# EAGLE design G008A (EAGLE 6.6.0)
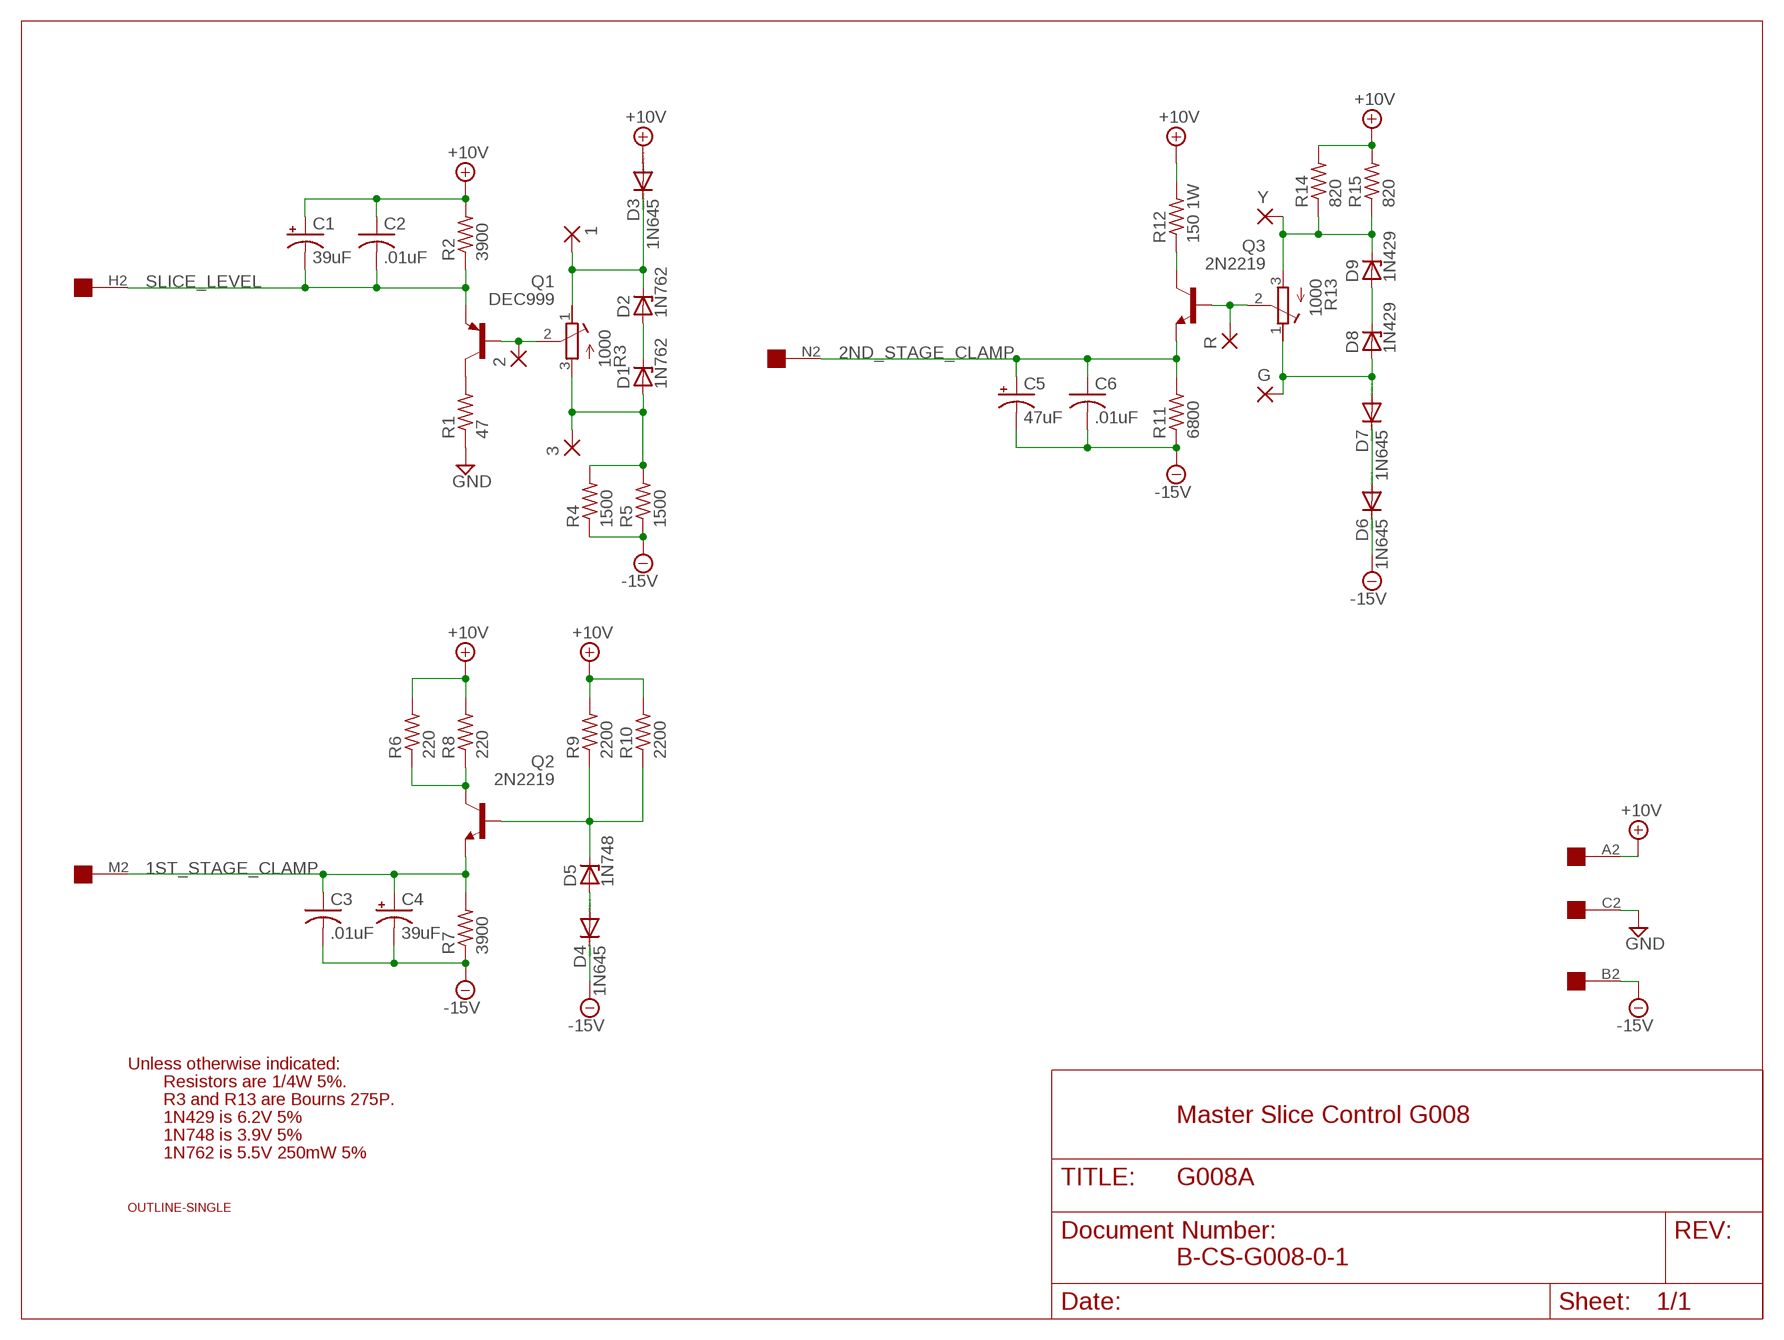
[diagram p0: schematic, sheet 1]

## Parts
1  2,54/0,8  [2,54/0,8]
2  2,54/0,8  [2,54/0,8]
3  2,54/0,8  [2,54/0,8]
C1  39uF  CPOL-USE15-5AXIAL  [E15-5]
C2  .01uF  C-US050-025X075  [C050-025X075]
C3  .01uF  C-US050-025X075  [C050-025X075]
C4  39uF  CPOL-USE15-5AXIAL  [E15-5]
C5  47uF  CPOL-USE22-6AXIAL  [E22-6]
C6  .01uF  C-US050-025X075  [C050-025X075]
D1  1N762  ZENER-DIODEDO35Z10  [DO35Z10]
D2  1N762  ZENER-DIODEDO35Z10  [DO35Z10]
D3  1N645  1N4148DO35-10  [DO35-10]
D4  1N645  1N4148DO35-10  [DO35-10]
D5  1N748  ZENER-DIODEDO35Z10  [DO35Z10]
D6  1N645  1N4148DO35-10  [DO35-10]
D7  1N645  1N4148DO35-10  [DO35-10]
D8  1N429  ZENER-DIODEDO35Z10  [DO35Z10]
D9  1N429  ZENER-DIODEDO35Z10  [DO35Z10]
G  2,54/0,8  [2,54/0,8]
Q1  DEC999  2N2904  [TO39]
Q2  2N2219  2N2102  [TO5]
Q3  2N2219  2N2102  [TO5]
R  2,54/0,8  [2,54/0,8]
R1  47  R-US_0207/10  [0207/10]
R2  3900  R-US_0207/10  [0207/10]
R3  1000  275P  [3006Y]
R4  1500  R-US_0207/10  [0207/10]
R5  1500  R-US_0207/10  [0207/10]
R6  220  R-US_0207/10  [0207/10]
R7  3900  R-US_0207/10  [0207/10]
R8  220  R-US_0207/10  [0207/10]
R9  2200  R-US_0207/10  [0207/10]
R10  2200  R-US_0207/10  [0207/10]
R11  6800  R-US_0207/10  [0207/10]
R12  150 1W  R-US_0617/22  [0617/22]
R13  1000  275P  [3006Y]
R14  820  R-US_0207/10  [0207/10]
R15  820  R-US_0207/10  [0207/10]
U$1  OUTLINE-SINGLE  [SINGLE]
U$2  EDGE-1  [EDGE-CON1]
Y  2,54/0,8  [2,54/0,8]

## Nets
1ST_STAGE_CLAMP: C3.1 C4.+ Q2.1(E) R7.2 U$2.M2
2ND_STAGE_CLAMP: C5.+ C6.1 Q3.1(E) R11.2 U$2.N2
+10V: C1.+ C2.1 D3.A R2.2 R6.2 R8.2 R9.2 R10.2 R12.2 R14.2 R15.2 U$2.A2
-15V: C3.2 C4.- C5.- C6.2 D4.C D6.C R4.1 R5.1 R7.1 R11.1 U$2.B2
GND [Supply]: R1.1 U$2.C2
N$1: 3.1(P) D1.A R3.3(E) R4.2 R5.2
N$2: Q2.3(C) R6.1 R8.1
N$3: D1.C D2.A
N$4: Q1.3(C) R1.2
N$5: D4.A D5.A
N$6: Q3.3(C) R12.1
N$7: D5.C Q2.2(B) R9.1 R10.1
N$8: Q3.2(B) R13.2(S) R.1(P)
N$9: D6.A D7.C
N$10: D7.A D8.A G.1(P) R13.1(A)
N$11: D8.C D9.A
N$12: D9.C R13.3(E) R14.1 R15.1 Y.1(P)
N$39: 1.1(P) D2.C D3.C R3.1(A)
N$40: 2.1(P) Q1.2(B) R3.2(S)
SLICE_LEVEL: C1.- C2.2 Q1.1(E) R2.1 U$2.H2
Unconnected: U$2.D2 U$2.E2 U$2.F2 U$2.J2 U$2.K2 U$2.L2 U$2.P2 U$2.R2 U$2.S2 U$2.T2 U$2.U2 U$2.V2

## Notes on the sheet
- Unless otherwise indicated:
- Resistors are 1/4W 5%.
- R3 and R13 are Bourns 275P.
- 1N429 is 6.2V 5% | Master Slice Control G008
- 1N748 is 3.9V 5%
- 1N762 is 5.5V 250mW 5%
- B-CS-G008-0-1

## Library data of the parts
1-3 G R Y = wirepad:2,54/0,8: THROUGH-HOLE PAD
C1 C4 C5 = rcl:CPOL-US: POLARIZED CAPACITOR, American symbol
C2 C3 C6 = rcl:C-US: CAPACITOR, American symbol
D1 D2 D5 D8 D9 = diode:ZENER-DIODE: Z-Diode
D3 D4 D6 D7 = diode:1N4148: DIODE high speed (Philips)
Q1 = transistor-pnp:2N2904*: PNP Transistror
Q2 Q3 = transistor:2N2102: NPN TRANSISTOR
R1 R2 R4-R12 R14 R15 = rcl:R-US_: RESISTOR, American symbol
R3 R13 = dec-con:275P: Trimpot with 275P (3006Y) footprint.
U$1 = dec-con:OUTLINE-*: Board outlines for DEC boards.
U$2 = dec-con:EDGE-1: Single-Sided DEC Edge Connector -- (side 2)

## Net classes
1 Supply: width 0.813 mm

## Board
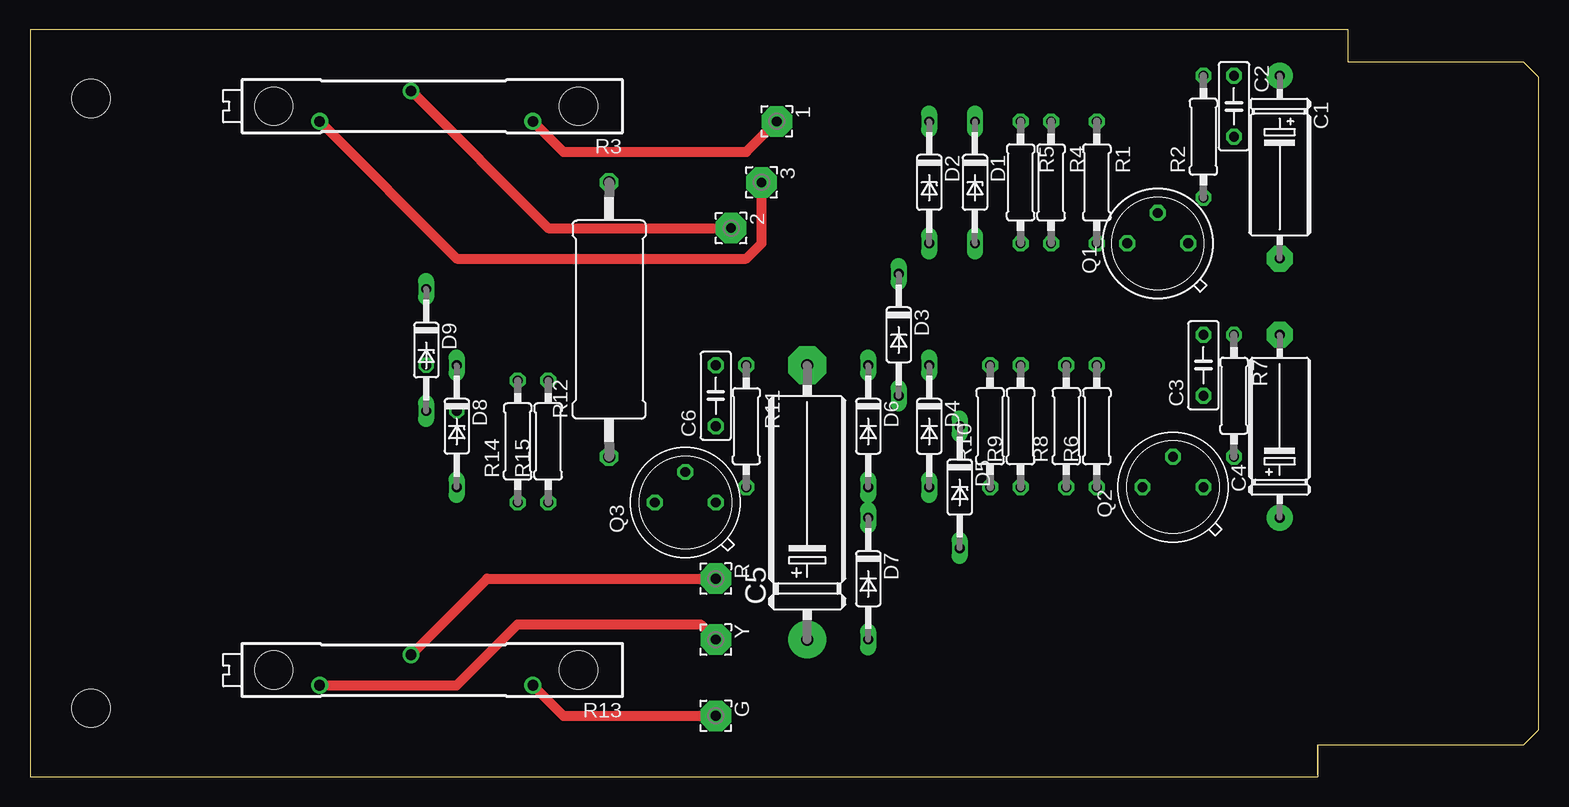
[diagram p1: board, top side]
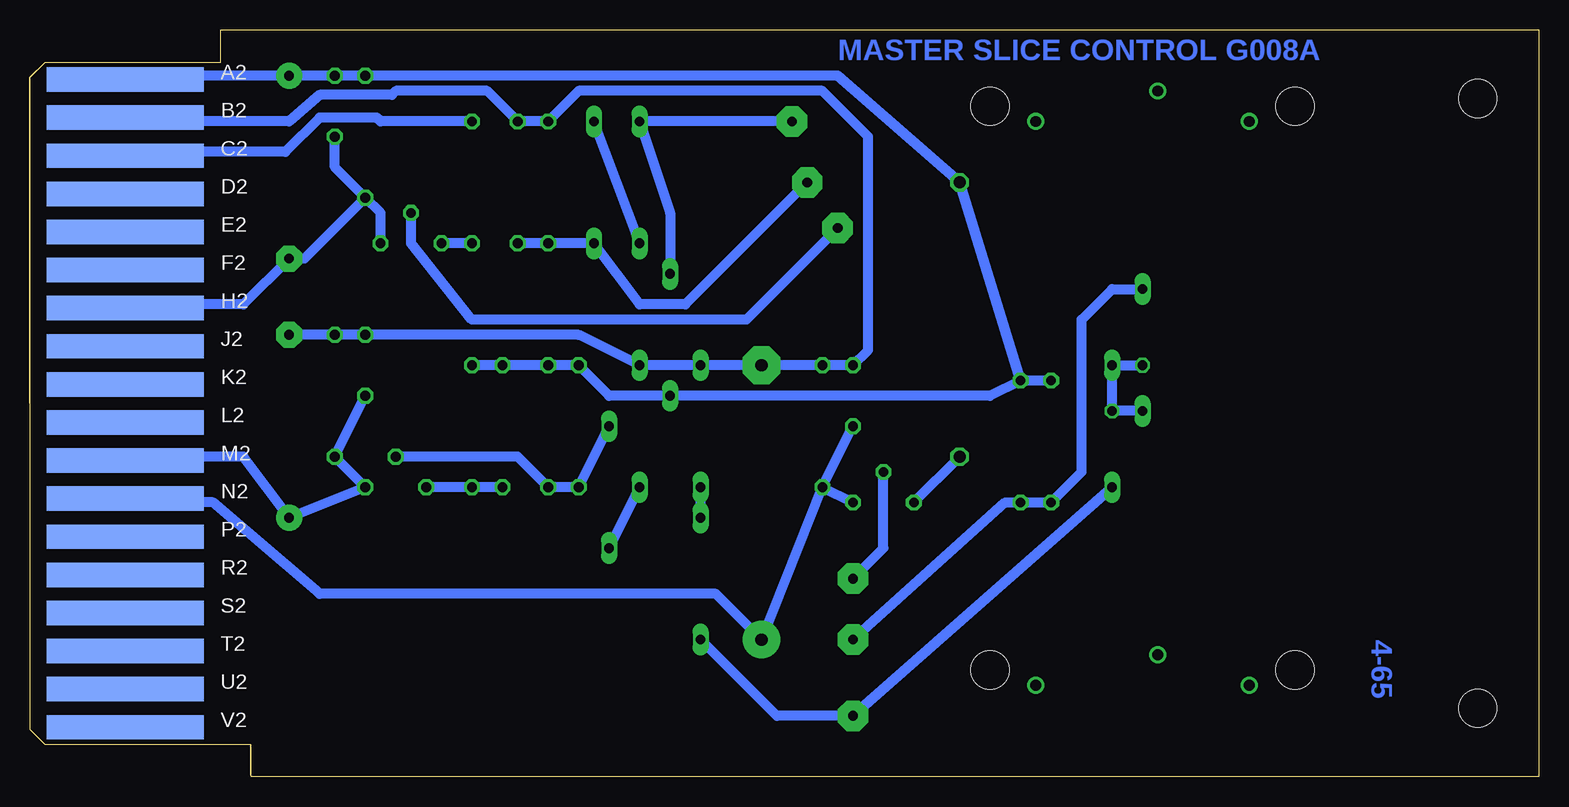
[diagram p2: board, bottom side, seen from below]

Size 125.73 x 62.23 mm. Coordinates in mm from the lower left corner, seen from the top.
Copper layers (1+16): Top 0.035mm / dielectric 1.5mm / Bottom 0.035mm
Design rules "16mils": minimum track width 16mil, minimum drill 32mil, track to track 15mil, track to pad 10mil, pad to pad 10mil, via to via 10mil, smd to smd 10mil, copper to edge 13mil, drill to drill 10mil, minimum pad ring 10mil, minimum via ring 8mil, stop-mask expansion 0mil, vias tented up to drill 0mil, thermal gap 10mil
Holes 3.17 mm at 20.32,55.88 45.72,55.88 20.32,8.89 45.72,8.89

### Footprints (pad centres in the part's own frame; a part is rotated, then mirrored left to right if it is on the bottom)
2,54/0,8 = drill 0.813 pad 2.54 octagon: 1 0,0
E15-5 = drill 0.813 pad 2.159: + -7.62,0 | drill 0.813 pad 2.159 octagon: - 7.62,0
C050-025X075 = drill 0.813 octagon: 1 -2.54,0; 2 2.54,0
E22-6 = drill 1.016 pad 3.15: + -11.43,0 | drill 1.016 pad 3.15 octagon: - 11.43,0
DO35Z10 = drill 0.813 long: A 5.08,0; C -5.08,0
DO35-10 = drill 0.813 long: A 5.08,0; C -5.08,0
TO39 = drill 0.813 octagon: 1 0,-2.54; 2 2.54,0; 3 0,2.54
TO5 = drill 0.813 octagon: 1 0,-2.54; 2 2.54,0; 3 0,2.54
0207/10 = drill 0.813 octagon: 1 -5.08,0; 2 5.08,0
3006Y = drill 0.9: 1 -8.89,1.27; 2 1.27,-1.27; 3 8.89,1.27
0617/22 = drill 1.016 octagon: 1 -11.43,0; 2 11.43,0
SINGLE = hole 3.175: 120.65,56.515; 120.65,5.715
EDGE-CON1 = smd 13.106 x 2.032 bottom: A2 7.938,4.128; B2 7.938,7.303; C2 7.938,10.477; D2 7.938,13.652; E2 7.938,16.828; F2 7.938,20.003; H2 7.938,23.177; J2 7.938,26.352; K2 7.938,29.527; L2 7.938,32.703; M2 7.938,35.877; N2 7.938,39.053; P2 7.938,42.227; R2 7.938,45.403; S2 7.938,48.578; T2 7.938,51.752; U2 7.938,54.928; V2 7.938,58.102

### Placement (x,y rotation side)
1  62.23,54.61 270 top
2  58.42,45.72 270 top
3  60.96,49.53 270 top
C1  104.14,50.8 270 top
C2  100.33,55.88 270 top
C3  97.79,34.29 90 top
C4  104.14,29.21 90 top
C5  64.77,22.86 90 top
C6  57.15,31.75 90 top
D1  78.74,49.53 270 top
D2  74.93,49.53 270 top
D3  72.39,36.83 270 top
D4  74.93,29.21 270 top
D5  77.47,24.13 270 top
D6  69.85,29.21 270 top
D7  69.85,16.51 270 top
D8  35.56,29.21 270 top
D9  33.02,35.56 270 top
G  57.15,5.08 270 top
Q1  93.98,44.45 90 top
Q2  95.25,24.13 90 top
Q3  54.61,22.86 90 top
R  57.15,16.51 270 top
R1  88.9,49.53 270 top
R2  97.79,53.34 90 top
R3  33.02,55.88 180 top
R4  85.09,49.53 270 top
R5  82.55,49.53 270 top
R6  88.9,29.21 90 top
R7  100.33,31.75 270 top
R8  86.36,29.21 90 top
R9  82.55,29.21 90 top
R10  80.01,29.21 90 top
R11  59.69,29.21 270 top
R12  48.26,38.1 90 top
R13  33.02,8.89 180 top
R14  40.64,27.94 90 top
R15  43.18,27.94 90 top
U$1  125.73,62.23 180 top
U$2  125.73,62.23 180 top
Y  57.15,11.43 270 top

### Tracks (layer width: path | path; a pad name or v marks a point on that pad's centre or on a via)
1ST_STAGE_CLAMP
  Bottom 0.813: U$2.M2 116.84,26.67 107.95,26.67 C4.+ Q2.1 R7.2 C3.1
2ND_STAGE_CLAMP
  Bottom 0.813: U$2.N2 116.84,22.86 110.49,22.86 101.6,15.24 68.58,15.24 C5.+ R11.2 | R11.2 C6.1 | R11.2 Q3.1
+10V
  Bottom 0.813: U$2.A2 117.22,58.04 116.84,58.42 C1.+ C2.1 R2.2 58.42,58.42 R12.2 R15.2 | R15.2 45.72,31.75 D3.A 77.47,31.75 R10.2 R9.2 R8.2 R6.2 | R14.2 R15.2
-15V
  Bottom 0.813: U$2.B2 117.13,54.9 116.84,54.61 104.14,54.61 101.6,56.83 95.57,56.83 95.25,57.15 87.63,57.15 R4.1 R5.1 80.01,57.15 59.69,57.15 55.88,53.34 55.88,35.56 C6.2 R11.1 C5.- D6.C D4.C 80.01,36.83 C3.2 R7.1 C4.-
GND
  Bottom 0.813: U$2.C2 117.17,51.74 116.84,52.07 104.46,52.07 101.6,54.93 96.84,54.93 96.52,54.61 R1.1
N$1
  Top 0.813: R3.3 35.56,43.18 59.69,43.18 60.96,44.45 3.1
  Bottom 0.813: R4.2 R5.2 D1.A 74.93,39.37 71.12,39.37 3.1
N$2
  Bottom 0.813: Q2.3 R6.1 R8.1
N$3
  Bottom 0.813: D2.A D1.C
N$4
  Bottom 0.813: R1.2 Q1.3
N$5
  Bottom 0.813: D5.A D4.A
N$6
  Bottom 0.813: Q3.3 R12.1
N$7
  Bottom 0.813: Q2.2 85.09,26.67 R9.1 R10.1 D5.C
N$8
  Top 0.813: R13.2 38.1,16.51 R.1
  Bottom 0.813: R.1 54.61,19.05 Q3.2
N$9
  Bottom 0.813: D7.C D6.A
N$10
  Top 0.813: G.1 44.45,5.08 R13.1
  Bottom 0.813: D8.A G.1 63.5,5.08 D7.A
N$11  (via drill 0.81)
  Bottom 0.813: D9.A v35.56,30.48 D8.C v33.02,34.29
N$12
  Top 0.813: R13.3 35.56,7.62 40.64,12.7 55.88,12.7 Y.1
  Bottom 0.813: Y.1 44.45,22.86 R15.1 R14.1 38.1,25.4 38.1,38.1 35.56,40.64 D9.C
N$39
  Top 0.813: R3.1 44.45,52.07 59.69,52.07 1.1
  Bottom 0.813: 1.1 D2.C 72.39,46.99 D3.C
N$40
  Top 0.813: 2.1 43.18,45.72 R3.2
  Bottom 0.813: 2.1 66.04,38.1 88.9,38.1 93.98,44.45 Q1.2
SLICE_LEVEL
  Bottom 0.813: U$2.H2 117.17,39.04 116.84,39.37 107.95,39.37 C1.- 102.87,43.18 R2.1 | C2.2 100.33,50.8 R2.1 | Q1.1 96.52,46.99 R2.1

### Text on the board
Bottom: MASTER SLICE CONTROL G008A | 4-65